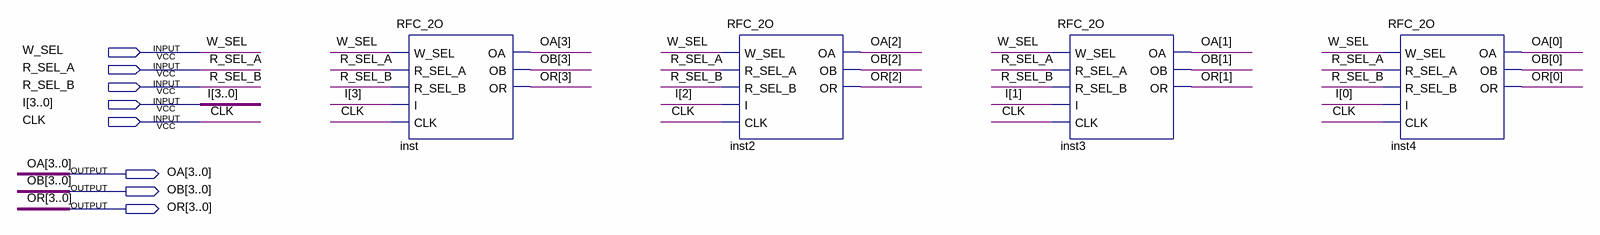
[diagram p0: schematic sheet]
// Quartus schematic RFC_2O_4bit.bdf as structural Verilog: 4 symbols, 8 pins
module RFC_2O_4bit (
  input  W_SEL,
  input  R_SEL_A,
  input  R_SEL_B,
  input  [3:0] I,
  input  CLK,
  output [3:0] OA,
  output [3:0] OB,
  output [3:0] OR
);

  RFC_2O inst (
    .W_SEL(W_SEL), .R_SEL_A(R_SEL_A), .R_SEL_B(R_SEL_B), .I(I[3]), .CLK(CLK), .OA(OA[3]), .OB(OB[3]),
    .OR(OR[3]));
  RFC_2O inst2 (
    .W_SEL(W_SEL), .R_SEL_A(R_SEL_A), .R_SEL_B(R_SEL_B), .I(I[2]), .CLK(CLK), .OA(OA[2]), .OB(OB[2]),
    .OR(OR[2]));
  RFC_2O inst3 (
    .W_SEL(W_SEL), .R_SEL_A(R_SEL_A), .R_SEL_B(R_SEL_B), .I(I[1]), .CLK(CLK), .OA(OA[1]), .OB(OB[1]),
    .OR(OR[1]));
  RFC_2O inst4 (
    .W_SEL(W_SEL), .R_SEL_A(R_SEL_A), .R_SEL_B(R_SEL_B), .I(I[0]), .CLK(CLK), .OA(OA[0]), .OB(OB[0]),
    .OR(OR[0]));
endmodule
